# Altium schematic sheet Resistor.SchDoc: Resistor
size A; DocumentNumber: 1; SheetNumber: 1; SheetTotal: 1
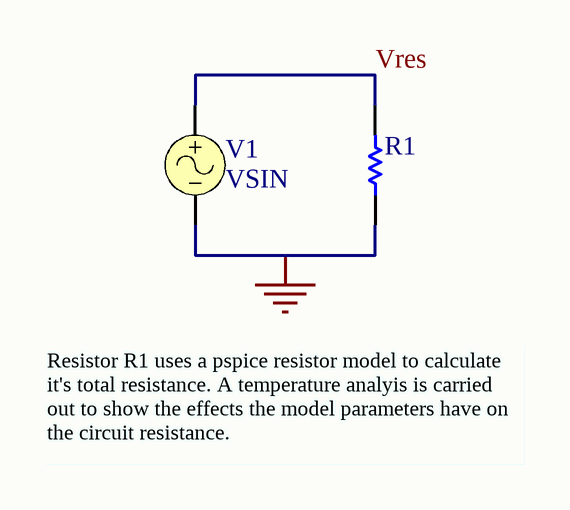
[diagram p0: Resistor.SchDoc]

## Parts
R1  Res1  [AXIAL-0.3]  (value not drawn)
V1  VSIN

## Nets
GND: R1.1 V1.2
Vres: R1.2 V1.1

## Notes on the sheet
- Resistor R1 uses a pspice resistor model to calculate it's total resistance. A temperature analyis is carried out to show the effects the model parameters have on the circuit resistance.
- Title
- Size:
- Date:
- A
- Number:
- Time:
- Revision:
- Sheet
- of
- File:

## Library data of the parts
R1 = Res1: Resistor; Published: 8-Jun-2000; LatestRevisionDate: 17-Jul-2002; LatestRevisionNote: Re-released for DXP Platform.; Publisher: Altium Limited
V1 = VSIN: Sinusoidal Voltage Source; Note: PCB Footprint - Not required; Published: 8-Jun-2000; LatestRevisionDate: 15-Nov-2004; LatestRevisionNote: Corrected Netlist.; PackageReference: Not Applicable; Publisher: Altium Limited